# EAGLE design Wheel Speed Sensor rev1.2 (EAGLE 9.5.0)
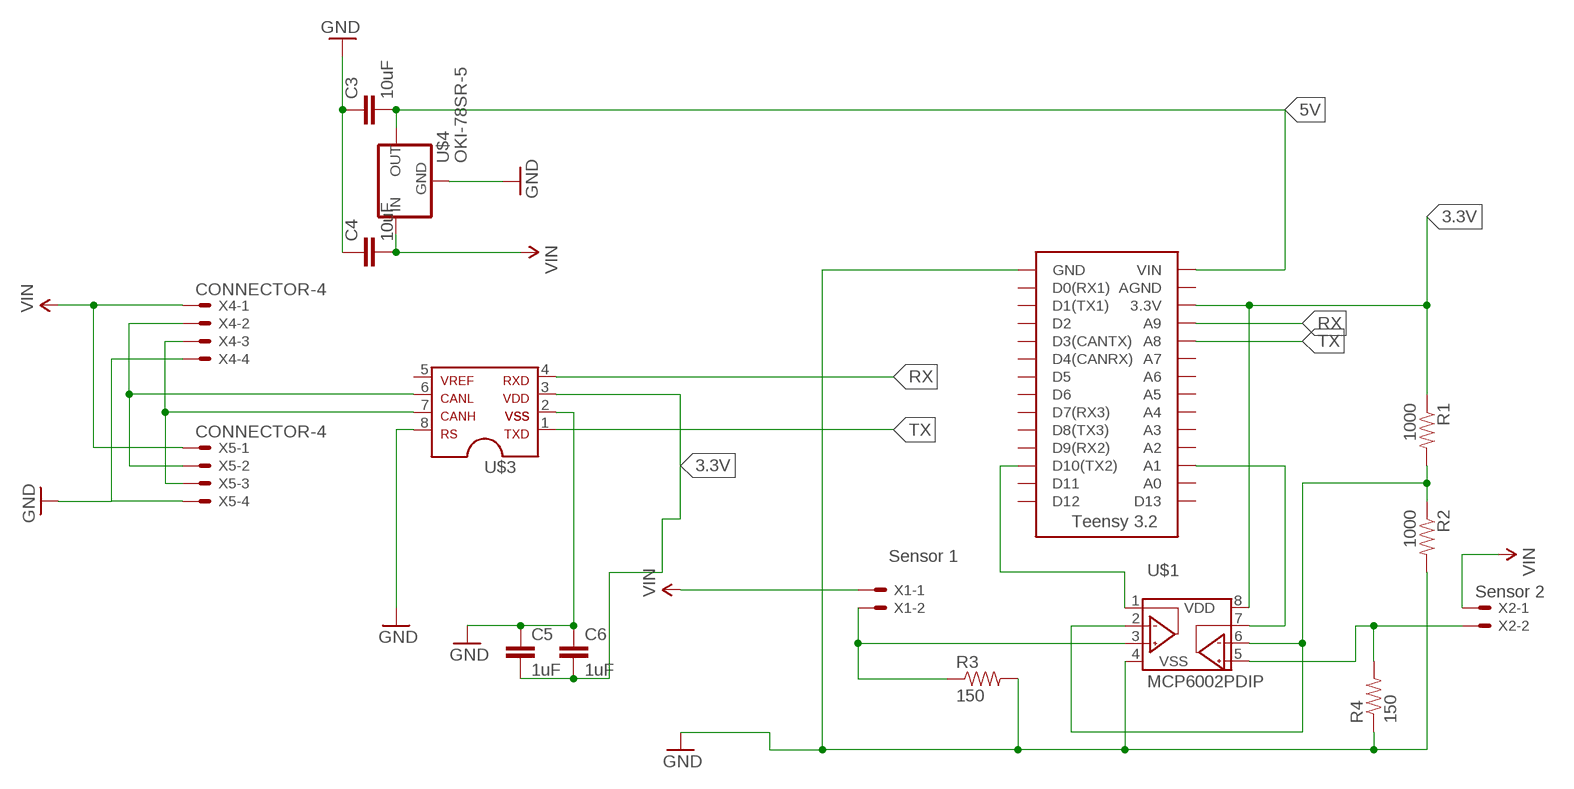
[diagram p0: schematic, sheet 1]

## Parts
C3  10uF  CAPEZ  [CAP-PTH-SMALLEZ]
C4  10uF  CAPEZ  [CAP-PTH-SMALLEZ]
C5  1uF  CAPPTH1  [CAP-PTH-5MM]
C6  1uF  CAPPTH1  [CAP-PTH-5MM]
R1  1000  RESISTORAXIAL-0.3  [AXIAL-0.3]
R2  1000  RESISTORAXIAL-0.3  [AXIAL-0.3]
R3  150  RESISTORAXIAL-0.3  [AXIAL-0.3]
R4  150  RESISTORAXIAL-0.3  [AXIAL-0.3]
U$1  MCP6002PDIP  [DIL08]
U$2  TEENSY_3.2_SIMPLE  [TEENSY_3.2_SIMPLE]
U$3  MCP2551DIL  [DIL08]
U$4  OKI-78SR-5  [OKI-78SR]
X1  Sensor 1  CONNECTOR-2  [MINIFIT_5566-2]
X2  Sensor 2  CONNECTOR-2  [MINIFIT_5566-2]
X4  CONNECTOR-4  [MINIFIT_5566-4]
X5  CONNECTOR-4  [MINIFIT_5566-4]

## Nets
3.3V: C5.2 C6.2 R1.P$1 U$1.8(VDD) U$2.3.3V U$3.3
5V: C3.2 U$2.VIN U$4.3(OUT)
CANH: U$3.7 X4.3 X5.3
GND: C3.1 C4.1 C5.1 C6.1 R2.P$2 R3.P$2 R4.P$1 U$1.4(VSS) U$2.GND U$3.2 U$3.8 U$4.2(GND) X4.4 X5.4
N$2: R1.P$2 R2.P$1 U$1.2(VINA-) U$1.6(VINB-)
N$3: U$3.6 X4.2 X5.2
N$4: R3.P$1 U$1.3(VINA+) X1.2
N$5: U$1.7(VOUTB) U$2.A1
N$6: U$1.1(VOUTA) U$2.D10(TX2)
N$8: R4.P$2 U$1.5(VINB+) X2.2
RX: U$2.A9 U$3.4
TX: U$2.A8 U$3.1
VIN: C4.2 U$4.1(IN) X1.1 X2.1 X4.1 X5.1
Unconnected: U$2.A0 U$2.A2 U$2.A3 U$2.A4 U$2.A5 U$2.A6 U$2.A7 U$2.AGND U$2.D0(RX1) U$2.D1(TX1) U$2.D2 U$2.D3(CANTX) U$2.D4(CANRX) U$2.D5 U$2.D6 U$2.D7(RX3) U$2.D8(TX3) U$2.D9(RX2) U$2.D11 U$2.D12 U$2.D13 U$3.5

## Library data of the parts
C3-C6 = HyTechDevices:CAP: Capacitor Standard 0603 ceramic capacitor, and 0.1" leaded capacitor.
R1-R4 = HyTechDevices:RESISTOR: Resistor Basic schematic elements and footprints for 0603, 1206, and PTH resistors.
U$1 = HyTechDevices:MCP6002: Microchip MCP6002 Dual Channel Op Amp
U$2 = HyTechDevices:TEENSY_3.2_SIMPLE: Simple version of the Teensy 3.2 board that only uses the 2 main rows of pins, not the inner pins or the pins opposite the usb port.
U$3 = HyTechDevices:MCP2551: MCP2551 High-Speed CAN Transceiver Product Webpage <https://www.microchip.com/wwwproducts/en/MCP2551> Datasheet <http://ww1.microchip.com/downloads/en/DeviceDoc/21667f.pdf> This device is outdated It is replaced by MCP2561. Comparison Page <https://www.microchip.com/wwwproducts/ProductCompare/MCP2551/MCP2561> Product Webpage <https://www.microchip.com/wwwproducts/en/MCP2561> Datasheet <http://ww1.microchip.com/downloads/en/DeviceDoc/20005167C.pdf>
U$4 = HyTechDevices:OKI-78SR-5: Murata OKI-78SR 5V 1.5A Non-Isolated Switching Regulator DC/DC - Datasheet <https://power.murata.com/data/power/oki-78sr.pdf>
X1 X2 = HyTechDevices:CONNECTOR-2: Mini-Fit Junior connector 2 pole Source: http://www.molex.com; OC_FARNELL: 1822072; OC_NEWARK: unknown
X4 X5 = HyTechDevices:CONNECTOR-4: Mini-Fit Junior connector 4 pole Source: http://www.molex.com; OC_FARNELL: unknown; OC_NEWARK: unknown

## Board
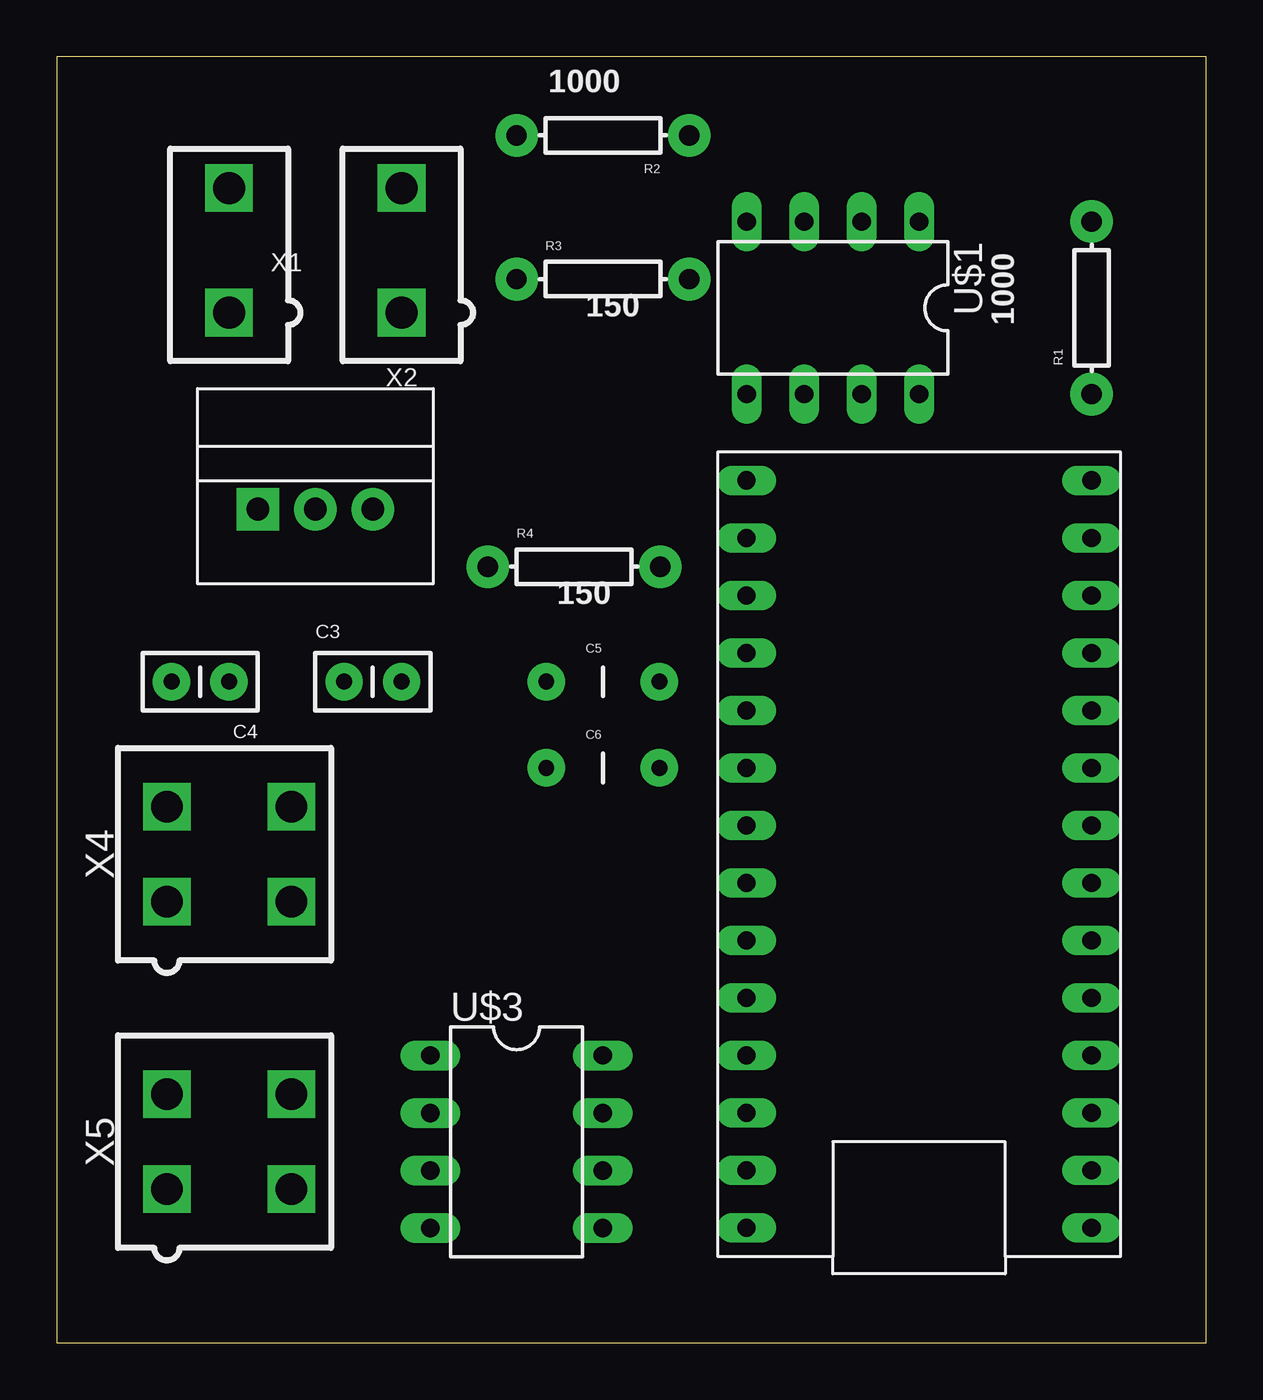
[diagram p1: board, top side]
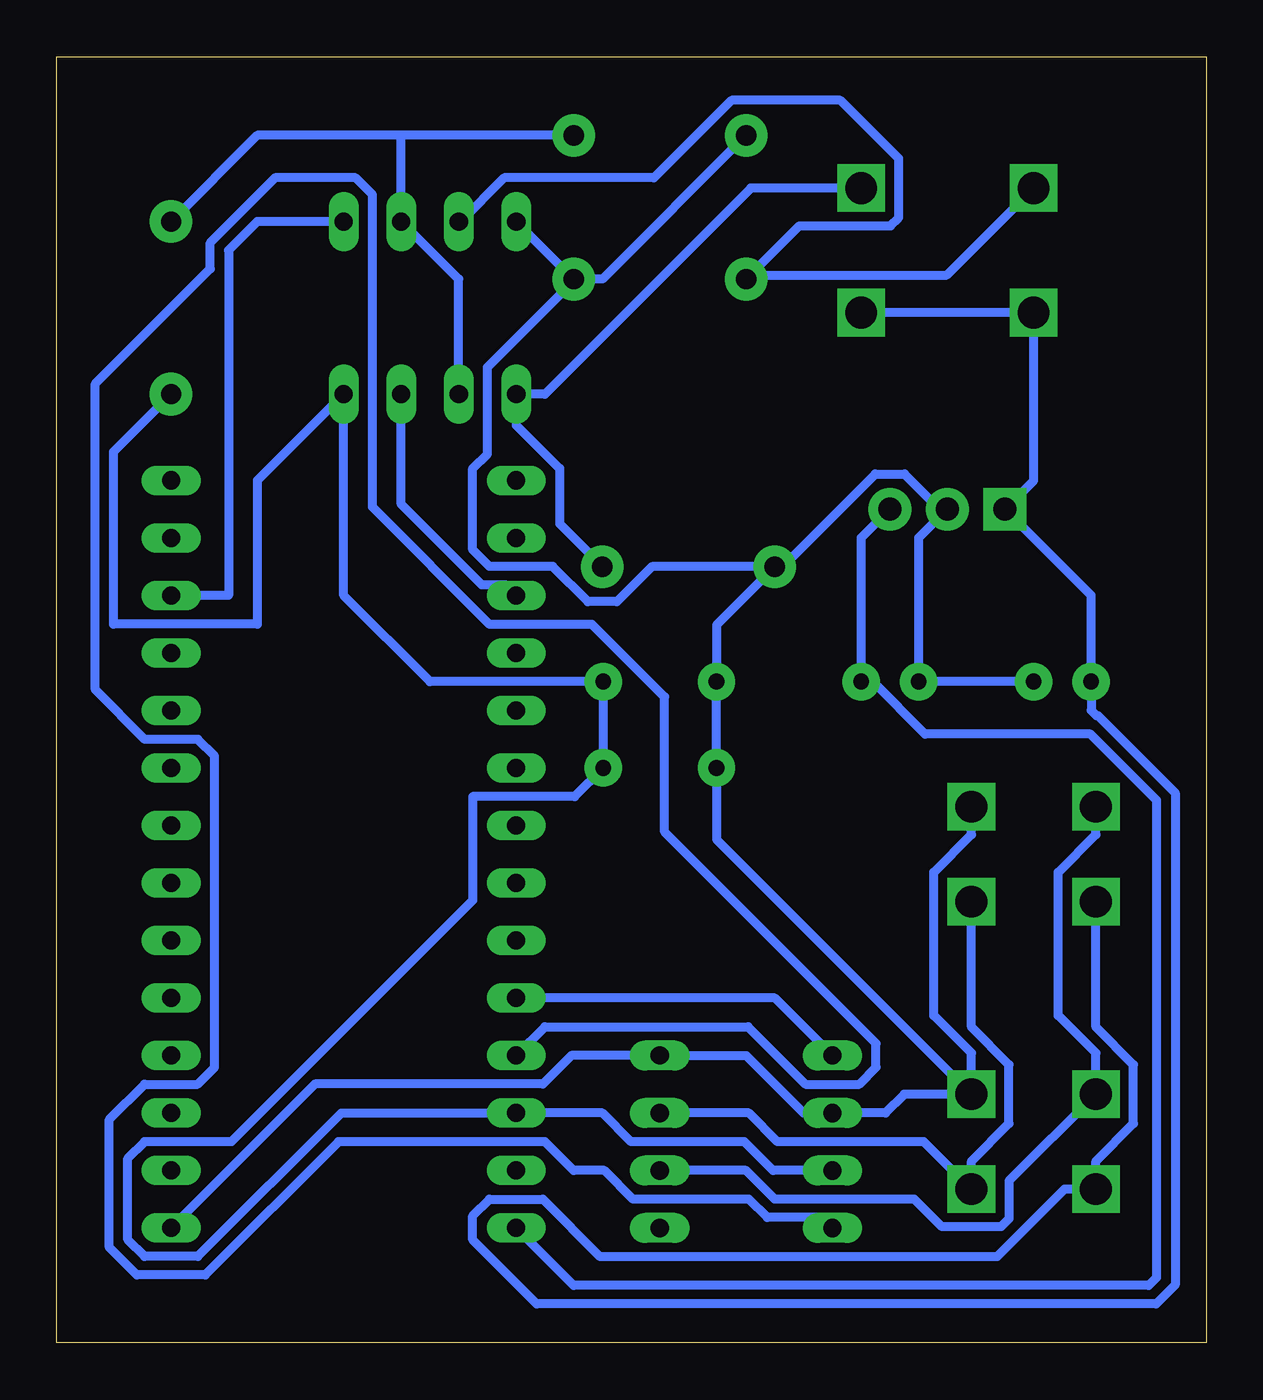
[diagram p2: board, bottom side, seen from below]

Size 50.78 x 56.82 mm. Coordinates in mm from the lower left corner, seen from the top.
Outline: 0,0 50.78,0 50.78,56.82 0,56.82 0,0
Copper layers (1*16): Top 0.035mm / dielectric 1.5mm / Bottom 0.035mm
Design rules "default *": minimum track width 16mil, minimum drill 0.35mm, track to track 16mil, track to pad 16mil, pad to pad 16mil, via to via 16mil, smd to smd 16mil, copper to edge 40mil, drill to drill 6mil, minimum pad ring 10mil, minimum via ring 8mil, stop-mask expansion 4mil, vias tented up to drill 0mil, thermal gap 10mil

### Footprints (pad centres in the part's own frame; a part is rotated, then mirrored left to right if it is on the bottom)
CAP-PTH-SMALLEZ = drill 0.7 pad 1.651: 1 0,0; 2 2.54,0
CAP-PTH-5MM = drill 0.7 pad 1.651: 1 -2.5,0; 2 2.5,0
AXIAL-0.3 = drill 0.9 pad 1.88: P$1 -3.81,0; P$2 3.81,0
DIL08 = drill 0.813 long: 1 -3.81,-3.81; 2 -1.27,-3.81; 3 1.27,-3.81; 4 3.81,-3.81; 5 3.81,3.81; 6 1.27,3.81; 7 -1.27,3.81; 8 -3.81,3.81
TEENSY_3.2_SIMPLE = drill 0.8 long: 3.3V 16.51,29.21; A0 16.51,3.81; A1 16.51,6.35; A2 16.51,8.89; A3 16.51,11.43; A4 16.51,13.97; A5 16.51,16.51; A6 16.51,19.05; A7 16.51,21.59; A8 16.51,24.13; A9 16.51,26.67; AGND 16.51,31.75; D0(RX1) 1.27,31.75; D1(TX1) 1.27,29.21; D2 1.27,26.67; D3(CANTX) 1.27,24.13; D4(CANRX) 1.27,21.59; D5 1.27,19.05; D6 1.27,16.51; D7(RX3) 1.27,13.97; D8(TX3) 1.27,11.43; D9(RX2) 1.27,8.89; D10(TX2) 1.27,6.35; D11 1.27,3.81; D12 1.27,1.27; D13 16.51,1.27; GND 1.27,34.29; VIN 16.51,34.29
OKI-78SR = drill 1 pad 1.88 square: 1 -2.54,0 | drill 1 pad 1.88: 2 0,0; 3 2.54,0
MINIFIT_5566-2 = drill 1.4 square: 1 0,-2.75; 2 0,2.75
MINIFIT_5566-4 = drill 1.4 square: 1 2.1,-2.75; 2 -2.1,-2.75; 3 2.1,2.75; 4 -2.1,2.75

### Placement (x,y rotation side)
C3  12.7,29.21 0 top
C4  7.62,29.21 180 top
C5  24.13,29.21 0 top
C6  24.13,25.4 0 top
R1  45.72,45.72 90 top
R2  24.13,53.34 180 top
R3  24.13,46.99 0 top
R4  22.86,34.29 0 top
U$1  34.29,45.72 180 top
U$2  46.99,39.37 180 top
U$3  20.32,8.89 270 top
U$4  11.43,36.83 0 top
X1  7.62,48.26 0 top
X2  15.24,48.26 0 top
X4  7.62,21.59 270 top
X5  7.62,8.89 270 top

### Tracks (layer width: path | path; a pad name or v marks a point on that pad's centre or on a via)
3.3V
  Bottom 0.406: R1.P$1 48.26,39.37 48.26,31.75 41.91,31.75 41.91,38.1 U$1.8 38.1,33.02 34.29,29.21 C5.2 C6.2 27.89,24.14 32.4,24.14 32.4,19.55 43.07,8.88 46.9,8.88 47.64,8.14 47.64,4.56 46.9,3.82 44.54,3.82 38.2,10.16 U$2.3.3V 26.67,10.16 25.4,8.89 20.4,8.89 19.13,7.62 U$3.3
5V
  Bottom 0.406: U$4.3 15.24,35.56 C3.2 14.73,29.21 12.42,26.9 5.12,26.9 2.18,23.97 2.18,2.9 2.54,2.54 27.94,2.54 U$2.VIN
CANH
  Bottom 0.406: U$3.7 20.2,10.16 18.93,8.89 12.47,8.89 X5.3 10.37,8.03 8.71,9.69 8.71,12.29 10.37,13.95 X4.3
GND
  Bottom 0.406: C4.1 C3.1 12.7,35.56 U$4.2 11.78,36.83 13.33,38.38 14.61,38.38 18.7,34.29 R4.P$1 | R2.P$2 26.67,46.99 R3.P$2 | R3.P$2 27.94,46.91 31.75,43.1 31.75,39.27 32.4,38.62 32.4,35.04 31.66,34.3 28.87,34.3 27.31,32.74 26.03,32.74 24.48,34.29 R4.P$1 | U$1.4 R3.P$2 | U$2.GND 39.36,11.44 29.3,11.44 28.04,12.7 U$3.8 20.32,12.7 17.78,10.16 U$3.2 14.16,10.16 13.33,10.99 X5.4 | X5.4 10.37,12.8 12.03,14.46 12.03,20.79 10.37,22.45 X4.4 | R4.P$1 21.63,31.71 C5.1 C6.1 21.63,22.25 X5.4
N$2
  Bottom 0.406: R2.P$1 35.56,53.34 | 35.56,53.34 41.91,53.34 R1.P$2 | 35.56,53.34 U$1.2 33.02,46.99 U$1.6
N$3
  Bottom 0.406: U$3.6 20.32,7.62 19.05,6.35 12.89,6.35 11.67,5.13 9.07,5.13 8.71,5.49 8.71,7.15 X5.2 4.87,12.8 6.53,14.46 6.53,20.79 4.87,22.45 X4.2
N$4
  Bottom 0.406: X1.2 11.46,47.17 20.14,47.17 R3.P$1 17.96,49.35 13.94,49.35 13.58,49.71 13.58,52.31 16.16,54.89 20.96,54.89 24.39,51.46 31.01,51.46 32.94,49.53 U$1.3
N$5
  Bottom 0.406: U$2.A1 30.94,33.48 31.99,33.48 35.56,37.05 U$1.7
N$6
  Bottom 0.406: U$1.1 41.91,49.53 43.18,48.26 43.18,33.02 U$2.D10(TX2)
N$8
  Bottom 0.406: R4.P$2 28.56,36.18 28.56,38.62 30.48,40.54 U$1.5 29.21,41.91 20.11,51.01 X2.2
RX
  Bottom 0.406: U$2.A9 29.21,13.97 20.24,13.97 17.7,11.43 15.32,11.43 14.58,12.17 14.58,13.23 23.93,22.57 23.93,28.53 27.13,31.74 31.65,31.74 36.83,36.93 36.83,50.72 37.57,51.46 41.13,51.46 43.99,48.6 43.99,47.45 49.07,42.37 49.07,28.85 46.89,26.66 44.54,26.66 43.8,25.92 43.8,12.18 44.55,11.42 46.9,11.42 48.45,9.87 48.45,4.22 47.23,3 44.21,3 38.33,8.88 29.2,8.88 27.94,7.62 26.59,7.62 25.32,6.35 20.2,6.35 19.39,5.54 16.97,5.54 U$3.4
TX
  Bottom 0.406: U$3.1 19.05,15.24 U$2.A8
VIN
  Bottom 0.406: X2.1 X1.1 7.62,38.1 U$4.1 5.08,33.02 C4.2 5.08,27.94 4.85,27.71 4.78,27.71 1.37,24.3 1.37,2.56 2.2,1.73 29.57,1.73 32.4,4.56 32.4,5.6 31.66,6.34 29.3,6.34 26.77,3.81 9.24,3.81 6.26,6.79 X5.1 4.87,8.03 3.21,9.69 3.21,12.29 4.87,13.95 X4.1